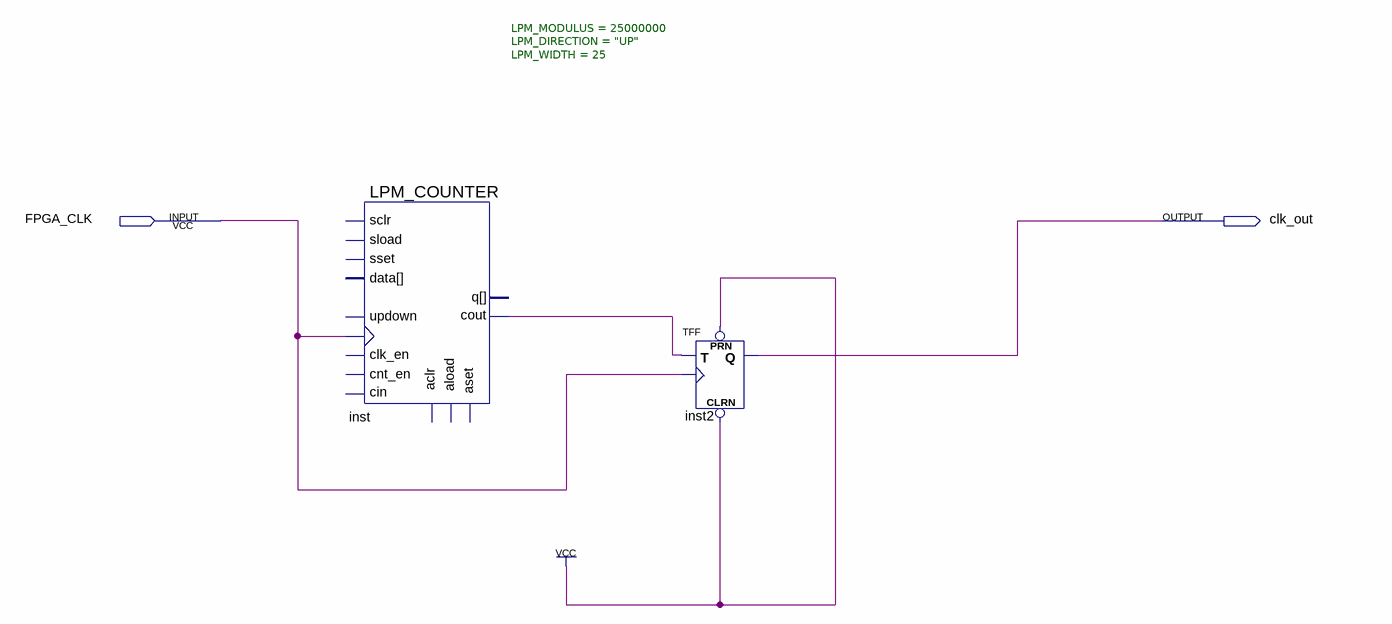
[diagram p0: schematic sheet]
// Quartus schematic freq_1hz.bdf as structural Verilog: 2 symbols, 2 pins
module freq_1hz (
  input  FPGA_CLK,
  output clk_out
);

  wire inst_cout;

  LPM_COUNTER #(.LPM_MODULUS(25000000), .LPM_DIRECTION("UP"), .LPM_WIDTH(25)) inst (
    .clock(FPGA_CLK), .cout(inst_cout));  // open: sload, data, clk_en, aload, aclr, aset, cin, sset, updown, cnt_en, sclr, q
  TFF inst2 (.PRN(1'b1), .CLRN(1'b1), .T(inst_cout), .CLK(FPGA_CLK), .Q(clk_out));
endmodule
